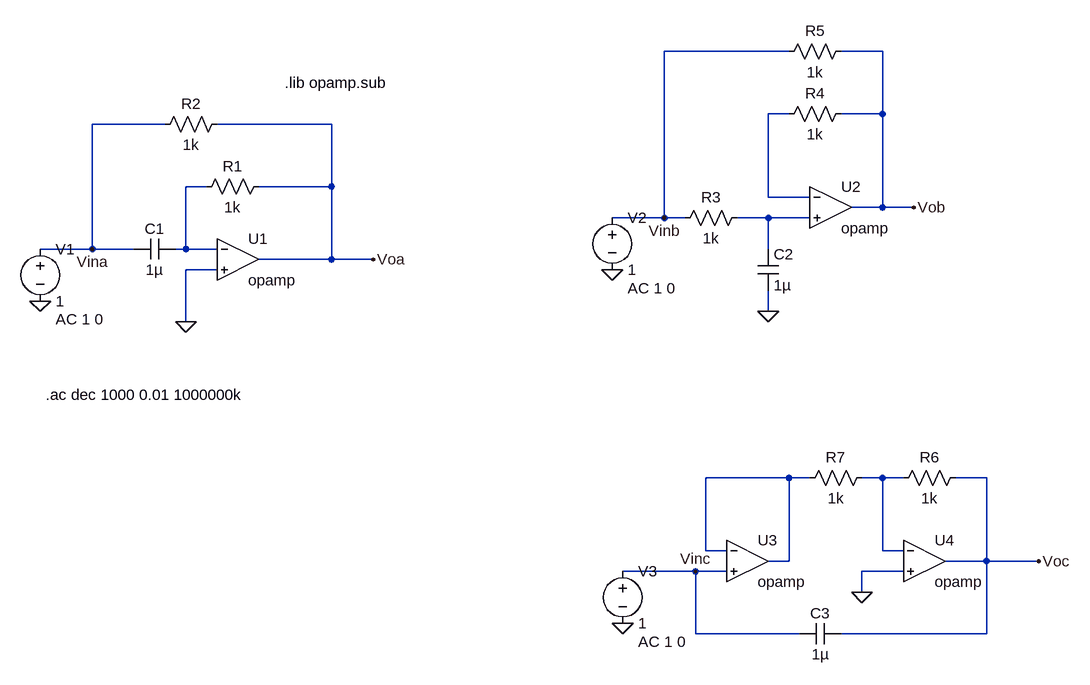
[diagram p0: schematic Ex2.asc]
Ex2.asc, the LTspice schematic file:
Version 4
SHEET 1 1484 752
WIRE 1040 -192 848 -192
WIRE 1184 -192 1120 -192
WIRE 1040 -96 1008 -96
WIRE 1184 -96 1184 -192
WIRE 1184 -96 1120 -96
WIRE 80 -80 -32 -80
WIRE 336 -80 160 -80
WIRE 144 16 112 16
WIRE 336 16 336 -80
WIRE 336 16 224 16
WIRE 1008 32 1008 -96
WIRE 1072 32 1008 32
WIRE 1184 48 1184 -96
WIRE 1184 48 1136 48
WIRE 1232 48 1184 48
WIRE 848 64 848 -192
WIRE 848 64 768 64
WIRE 880 64 848 64
WIRE 1008 64 960 64
WIRE 1072 64 1008 64
WIRE -32 112 -32 -80
WIRE -32 112 -112 112
WIRE 32 112 -32 112
WIRE 112 112 112 16
WIRE 112 112 96 112
WIRE 160 112 112 112
WIRE 1008 112 1008 64
WIRE 336 128 336 16
WIRE 336 128 224 128
WIRE 400 128 336 128
WIRE 160 144 112 144
WIRE 1008 208 1008 176
WIRE 112 224 112 144
WIRE 1040 464 912 464
WIRE 1072 464 1040 464
WIRE 1184 464 1152 464
WIRE 1216 464 1184 464
WIRE 1344 464 1296 464
WIRE 912 576 912 464
WIRE 944 576 912 576
WIRE 1184 576 1184 464
WIRE 1216 576 1184 576
WIRE 1040 592 1040 464
WIRE 1040 592 1008 592
WIRE 1344 592 1344 464
WIRE 1344 592 1280 592
WIRE 1424 592 1344 592
WIRE 896 608 784 608
WIRE 944 608 896 608
WIRE 1216 608 1152 608
WIRE 1152 640 1152 608
WIRE 896 704 896 608
WIRE 1056 704 896 704
WIRE 1344 704 1344 592
WIRE 1344 704 1120 704
FLAG 112 224 0
FLAG -112 192 0
FLAG -32 112 Vina
FLAG 400 128 Voa
FLAG 768 144 0
FLAG 1008 208 0
FLAG 1232 48 Vob
FLAG 848 64 Vinb
FLAG 1152 640 0
FLAG 784 688 0
FLAG 896 608 Vinc
FLAG 1424 592 Voc
SYMBOL OpAmps\\opamp 192 64 R0
SYMATTR InstName U1
SYMBOL cap 96 96 R90
WINDOW 0 0 32 VBottom 2
WINDOW 3 32 32 VTop 2
SYMATTR InstName C1
SYMATTR Value 1µ
SYMBOL res 240 0 R90
WINDOW 0 0 56 VBottom 2
WINDOW 3 32 56 VTop 2
SYMATTR InstName R1
SYMATTR Value 1k
SYMBOL res 176 -96 R90
WINDOW 0 0 56 VBottom 2
WINDOW 3 32 56 VTop 2
SYMATTR InstName R2
SYMATTR Value 1k
SYMBOL voltage -112 96 R0
WINDOW 123 24 124 Left 2
WINDOW 39 0 0 Left 0
SYMATTR Value2 AC 1 0
SYMATTR InstName V1
SYMATTR Value 1
SYMBOL OpAmps\\opamp 1104 -16 R0
SYMATTR InstName U2
SYMBOL OpAmps\\opamp 976 528 R0
SYMATTR InstName U3
SYMBOL OpAmps\\opamp 1248 528 R0
SYMATTR InstName U4
SYMBOL res 976 48 R90
WINDOW 0 0 56 VBottom 2
WINDOW 3 32 56 VTop 2
SYMATTR InstName R3
SYMATTR Value 1k
SYMBOL res 1136 -112 R90
WINDOW 0 0 56 VBottom 2
WINDOW 3 32 56 VTop 2
SYMATTR InstName R4
SYMATTR Value 1k
SYMBOL res 1136 -208 R90
WINDOW 0 0 56 VBottom 2
WINDOW 3 32 56 VTop 2
SYMATTR InstName R5
SYMATTR Value 1k
SYMBOL res 1312 448 R90
WINDOW 0 0 56 VBottom 2
WINDOW 3 32 56 VTop 2
SYMATTR InstName R6
SYMATTR Value 1k
SYMBOL res 1168 448 R90
WINDOW 0 0 56 VBottom 2
WINDOW 3 32 56 VTop 2
SYMATTR InstName R7
SYMATTR Value 1k
SYMBOL cap 992 112 R0
SYMATTR InstName C2
SYMATTR Value 1µ
SYMBOL voltage 768 48 R0
WINDOW 123 24 124 Left 2
WINDOW 39 0 0 Left 0
SYMATTR InstName V2
SYMATTR Value 1
SYMATTR Value2 AC 1 0
SYMBOL cap 1120 688 R90
WINDOW 0 0 32 VBottom 2
WINDOW 3 32 32 VTop 2
SYMATTR InstName C3
SYMATTR Value 1µ
SYMBOL voltage 784 592 R0
WINDOW 123 24 124 Left 2
WINDOW 39 0 0 Left 0
SYMATTR InstName V3
SYMATTR Value 1
SYMATTR Value2 AC 1 0
TEXT 264 -144 Left 2 !.lib opamp.sub
TEXT -104 336 Left 2 !.ac dec 1000 0.01 1000000k

The netlist it stands for:
* Ex2.asc
XU1 N002 0 Voa opamp Aol=100K GBW=10Meg  ; pins invin noninvin out
C1 N002 Vina 1µ
R1 Voa N002 1k
R2 Voa Vina 1k
V1 Vina 0 1 AC 1 0
XU2 N001 N003 Vob opamp Aol=100K GBW=10Meg  ; pins invin noninvin out
XU3 N004 Vinc N004 opamp Aol=100K GBW=10Meg  ; pins invin noninvin out
XU4 N005 0 Voc opamp Aol=100K GBW=10Meg  ; pins invin noninvin out
R3 N003 Vinb 1k
R4 Vob N001 1k
R5 Vob Vinb 1k
R6 Voc N005 1k
R7 N005 N004 1k
C2 N003 0 1µ
V2 Vinb 0 1 AC 1 0
C3 Voc Vinc 1µ
V3 Vinc 0 1 AC 1 0
.lib opamp.sub
.ac dec 1000 0.01 1000000k
.backanno
.end